# Altium schematic sheet current amplifier 05.SchDoc: PHOTOELECTRIC EFFECT
size A3; ApprovedBy: NHOPPASIT S.; CheckedBy: NHOPPASIT S.; Author: NHOPPASIT S.; DrawnBy: NHOPPASIT S.; DocumentNumber: EE-01; Revision: 1; SheetNumber: 1; SheetTotal: 1; Size: A3; PageSetup: Record=PageOptions|CenterHorizontal=True|CenterVertical=True|PrintScale=0.73|XCorrection=1.00|YCorrection=1.00|PrintKind=0|BorderSize=5000000|LeftOffset=0|BottomOffset=0|Orientation=2|PaperLength=1000|PaperWidth=1000|Scale=100|PaperSource=7|PrintQuality=-3|MediaType=1|DitherType=10|PrintScaleMode=1|PaperKind=A4|PaperIndex=9; DocumentName: PHOTOELECTRIC EFFECT SCH; ProjectName: PHOTOELECTRIC EFFECT 01
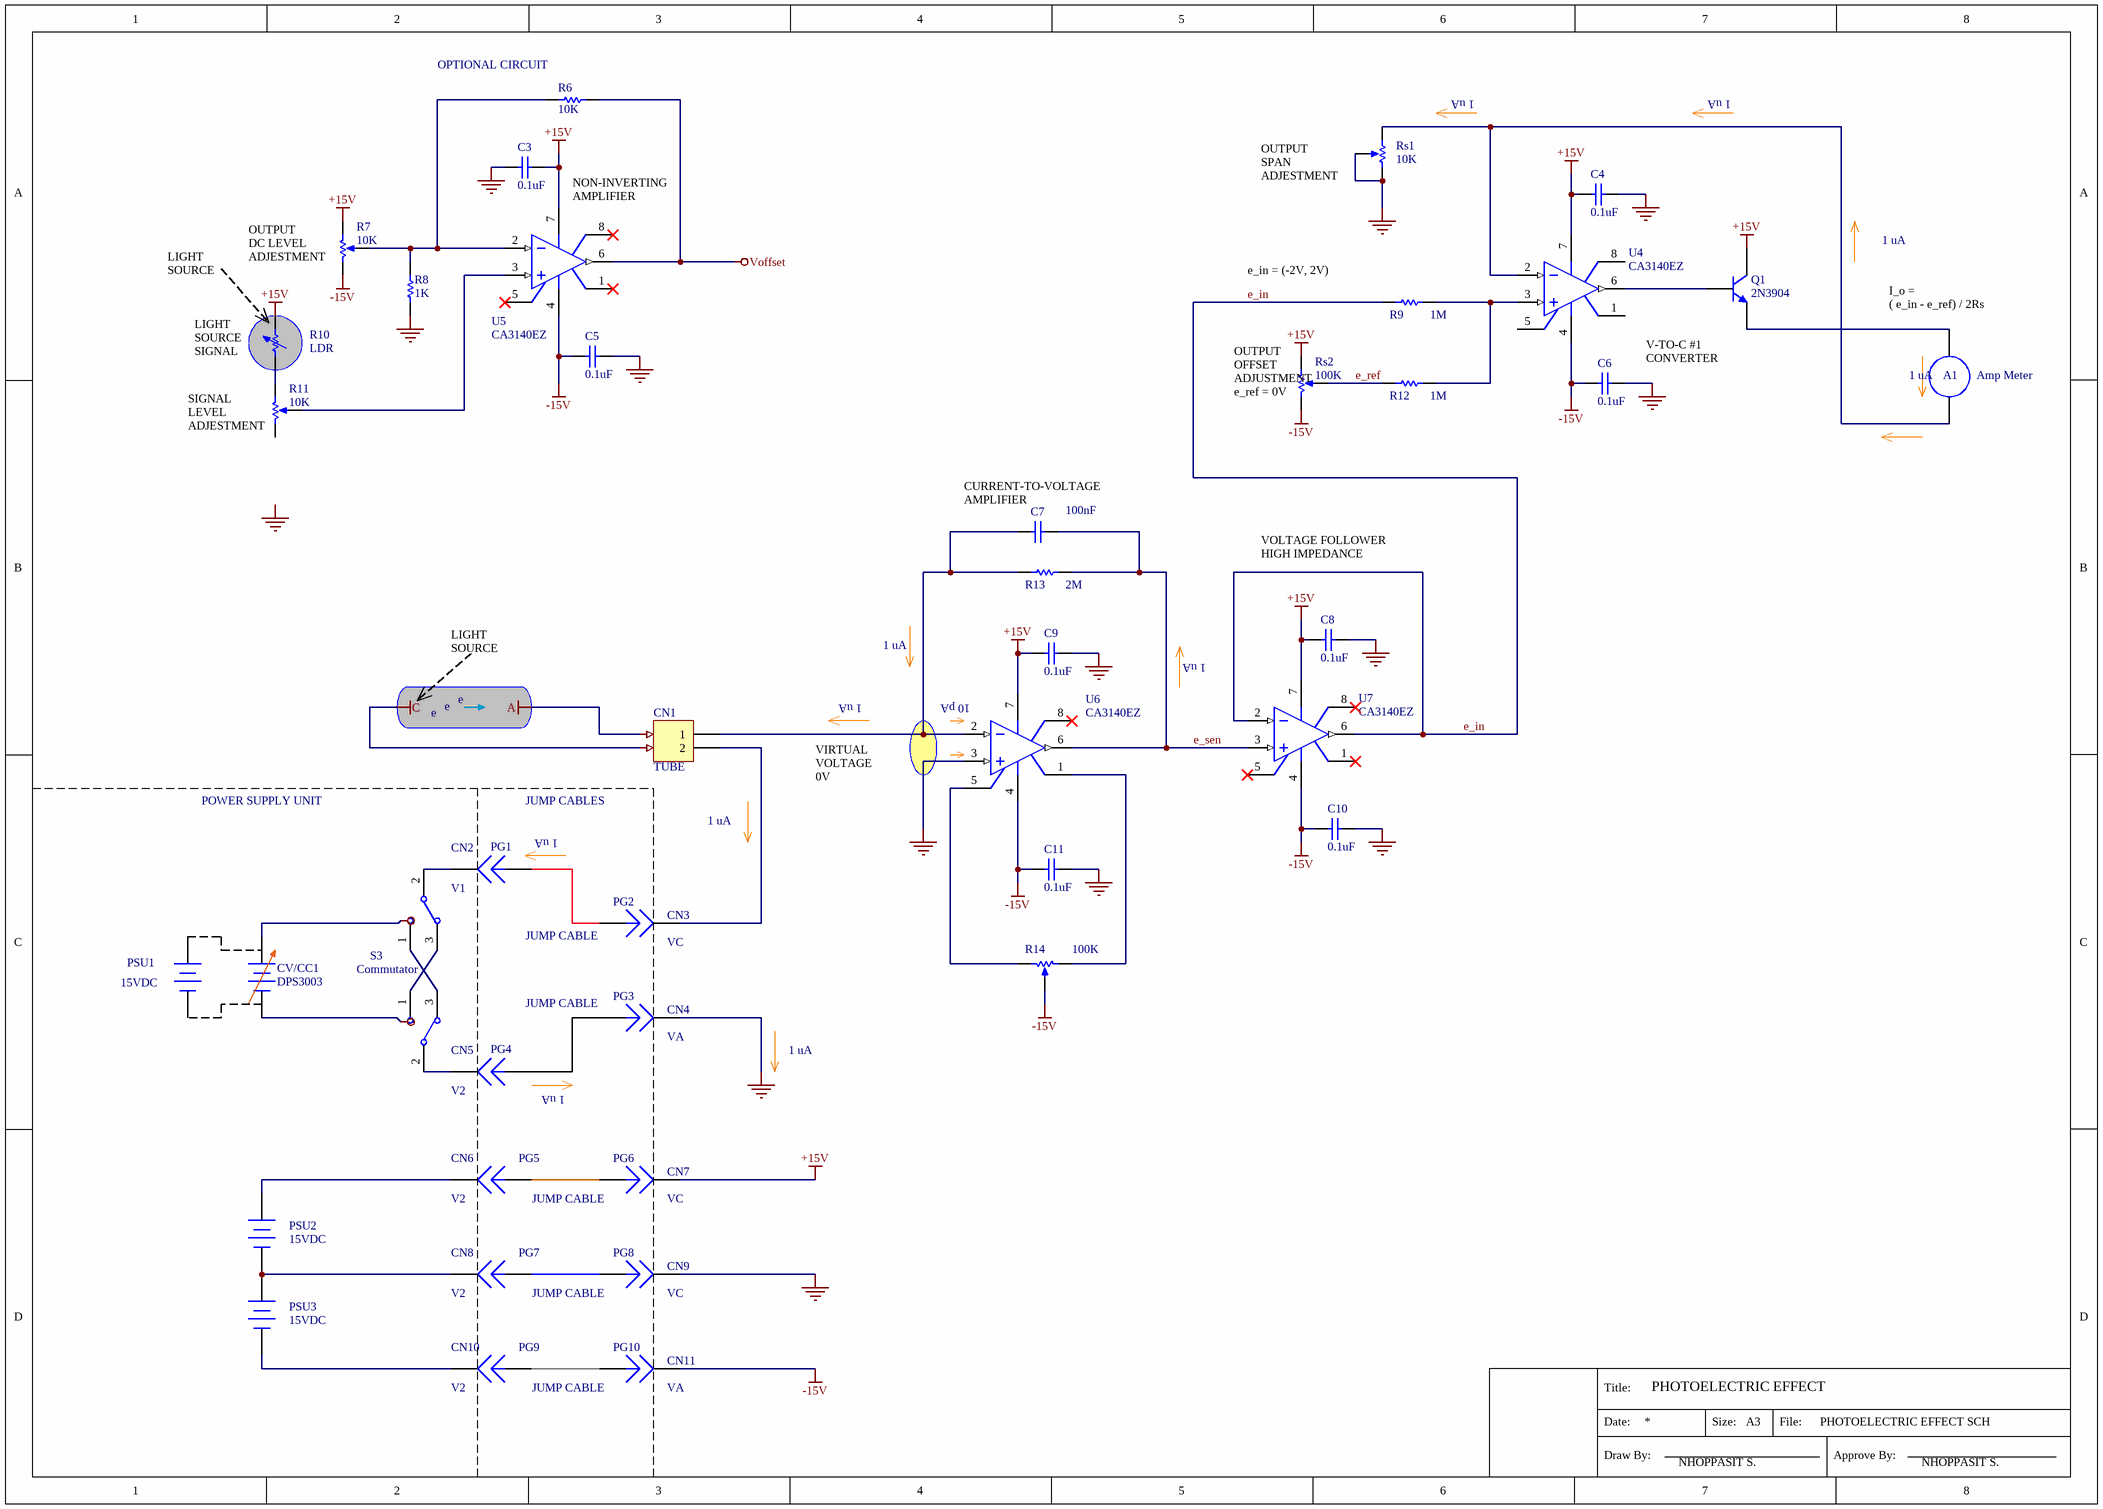
[diagram p0: current amplifier 05.SchDoc]

## Parts
A1  Amp Meter  [RAD-0.1]
C3  0.1uF  [RAD-0.3]
C4  0.1uF  [RAD-0.3]
C5  0.1uF  [RAD-0.3]
C6  0.1uF  [RAD-0.3]
C7  100nF  [RAD-0.3]
C8  0.1uF  [RAD-0.3]
C9  0.1uF  [RAD-0.3]
C10  0.1uF  [RAD-0.3]
C11  0.1uF  [RAD-0.3]
CN1  TUBE  [HDR1X2]
CN2  V1  [PIN1]
CN3  VC  [PIN1]
CN4  VA  [PIN1]
CN5  V2  [PIN1]
CN6  V2  [PIN1]
CN7  VC  [PIN1]
CN8  V2  [PIN1]
CN9  VC  [PIN1]
CN10  V2  [PIN1]
CN11  VA  [PIN1]
CV/CC1  DPS3003  [BAT-2]
PG1  Plug  [PIN1]  (value not drawn)
PG2  Plug  [PIN1]  (value not drawn)
PG3  Plug  [PIN1]  (value not drawn)
PG4  Plug  [PIN1]  (value not drawn)
PG5  Plug  [PIN1]  (value not drawn)
PG6  Plug  [PIN1]  (value not drawn)
PG7  Plug  [PIN1]  (value not drawn)
PG8  Plug  [PIN1]  (value not drawn)
PG9  Plug  [PIN1]  (value not drawn)
PG10  Plug  [PIN1]  (value not drawn)
PSU1  15VDC  [BAT-2]
PSU2  15VDC  [BAT-2]
PSU3  15VDC  [BAT-2]
Q1  2N3904  [TO-92A]
R6  10K  [AXIAL-0.3]
R7  10K  [VR5]
R8  1K  [AXIAL-0.3]
R9  1M  [AXIAL-0.3]
R10  LDR  [AXIAL-0.7]
R11  10K  [VR5]
R12  1M  [AXIAL-0.3]
R13  2M  [AXIAL-0.3]
R14  100K  [VR5]
Rs1  10K  [VR5]
Rs2  100K  [VR5]
S3  Commutator  [TL36WW15050]
S4  SW-SPDT  [TL36WW15050]  (value not drawn)
U4  CA3140EZ  [H-08A]
U5  CA3140EZ  [H-08A]
U6  CA3140EZ  [H-08A]
U7  CA3140EZ  [H-08A]

## Nets
+15V: C3.2 C4.1 C8.1 C9.1 CN7.1 Q1.3(C) R7.1(TOP) R10.2 Rs2.1(TOP) U4.7(V+) U5.7(V+) U6.7(V+) U7.7(V+)
-15V: C5.1 C6.1 C10.1 C11.1 CN11.1 R7.2(BOT) R14.3(TAP) Rs2.2(BOT) U4.4(V-) U5.4(V-) U6.4(V-) U7.4(V-)
A: CV/CC1.1(+) CV/CC1.2(-)  [also labelled C, VCC]
GND: C3.1 C4.2 C5.2 C6.2 C8.2 C9.2 C10.2 C11.2 CN4.1 CN9.1 R8.1 Rs1.2(BOT) Rs1.3(TAP) U6.3(IN+)
Voffset: R6.2 U5.6(OUT)
e_in: R9.1 U7.2(IN-) U7.6(OUT)
e_ref: R12.1 Rs2.3(TAP)
e_sen: C7.2 R13.2 U6.6(OUT) U7.3(IN+)
NetA1_1: A1.1 Rs1.1(TOP) U4.2(IN-)
NetA1_2: A1.2 Q1.1(E)
NetC7_1: C7.1 CN1.1 R13.1 U6.2(IN-)
NetCN1_2: CN1.2 CN3.1
NetCN2_1: CN2.1 S3.2
NetCN5_1: CN5.1 S4.2
NetCN6_1: CN6.1 PSU2.1(+)
NetCN8_1: CN8.1 PSU2.2(-) PSU3.1(+)
NetCN10_1: CN10.1 PSU3.2(-)
NetPG1_1: PG1.1 PG2.1
NetPG3_1: PG3.1 PG4.1
NetPG5_1: PG5.1 PG6.1
NetPG7_1: PG7.1 PG8.1
NetPG9_1: PG9.1 PG10.1
NetQ1_2: Q1.2(B) U4.6(OUT)
NetR6_1: R6.1 R7.3(TAP) R8.2 U5.2(IN-)
NetR9_2: R9.2 R12.2 U4.3(IN+)
NetR10_1: R10.1 R11.1(TOP)
NetR11_3: R11.3(TAP) U5.3(IN+)
NetR14_1: R14.1(TOP) U6.1(OS_NUL)
NetR14_2: R14.2(BOT) U6.5(OS_NUL)
NetS3_1: S3.1 S4.3
NetS3_3: S3.3 S4.1

Not connected (* = marked no-connect by the designer): PSU1 1(+) 2(-); R11 2(BOT); U4 1(OS_NUL) 5(OS_NUL) 8(TAB); U5 1(OS_NUL)* 5(OS_NUL)* 8(TAB)*; U6 8(TAB)*; U7 1(OS_NUL)* 5(OS_NUL)* 8(TAB)*

## Notes on the sheet
- (near R6) OPTIONAL CIRCUIT
- 1 uA
- (near Rs1) OUTPUT
  SPAN
  ADJESTMENT
- NON-INVERTING
  AMPLIFIER
- LIGHT SOURCE
- (near R7) OUTPUT
  DC LEVEL
  ADJESTMENT
- e_in = (-2V, 2V)
- (near A1) I_o =
  ( e_in - e_ref) / 2Rs
- (near R10) LIGHT SOURCE
  SIGNAL
- V-TO-C #1
  CONVERTER
- (near A1) 1 uA
- (near R11) SIGNAL
  LEVEL
  ADJESTMENT
- (near Rs2) OUTPUT
  OFFSET
  ADJUSTMENT
  e_ref = 0V
- (near C7) CURRENT-TO-VOLTAGE
  AMPLIFIER
- VOLTAGE FOLLOWER
  HIGH IMPEDANCE
- e
- (near U6) 10 pA
- VIRTUAL
  VOLTAGE
  0V
- POWER SUPPLY UNIT
- JUMP CABLES
- (near PG1) 1 uA
- JUMP CABLE
- (near PG4) 1 uA
- Labels drawn without touching a wire or pin: GND
- Title:
- Date:
- Draw By:
- Size:
- File:
- Approve By:

## Library data of the parts
A1 = Meter: Indicating Instrument; Note: Place a "letter" into the symbol to show the function of the meter or instrument; Published: 24-Mar-1999; LatestRevisionDate: 17-Jul-2002; LatestRevisionNote: Re-released for DXP Platform.; PackageReference: RAD-0.1; Publisher: Altium Limited; PackageDescription: Radial Cap, Thru-Hole; 2 Leads; 0.1 in Pin Spacing
C3-C11 = Cap: Capacitor; Published: 8-Jun-2000; LatestRevisionDate: 17-Jul-2002; LatestRevisionNote: Re-released for DXP Platform.; PackageReference: RAD-0.3; Publisher: Altium Limited; PackageDescription: Radial Cap, Thru-Hole; 2 Leads; 0.3 in Pin Spacing
  C3-C6 C8-C11: Value: 0.1uF
  C7: Value: 100nF
CN1 = Header 2: Header, 2-Pin; LatestRevisionDate: 17-Jul-2002; LatestRevisionNote: Re-released for DXP Platform.; Publisher: Altium Limited
CN2-CN11 = Socket: LatestRevisionDate: 17-Jul-2002; LatestRevisionNote: Re-released for DXP Platform.; Publisher: Altium Limited
CV/CC1 PSU1-PSU3 = Battery: Multicell Battery; Published: 24-Mar-1999; LatestRevisionDate: 17-Jul-2002; LatestRevisionNote: Re-released for DXP Platform.; PackageReference: BAT-2; Publisher: Altium Limited; PackageDescription: Battery; 2 Leads
Q1 = 2N3904: NPN General Purpose Amplifier; Published: 8-Jun-2000; LatestRevisionDate: 15-Jan-2003; LatestRevisionNote: PCB Footprint 'BCY-W3/D4.7' replaced; DatasheetVersion: 1997; PackageVersion: Sep-1998; PackageReference: TO-92A; Publisher: Altium Limited; PackageDescription: TO, Flat Index; 3 In-Line, Axial Leads; Body Dia. 4.5mm; Leads 0.51 x 0.48 mm (max); ComponentLink1Description: Manufacturer Link; ComponentLink1URL: http://www.fairchildsemi.com/; ComponentLink2Description: Datasheet; ComponentLink2URL: http://www.fairchildsemi.com/ds/2N%2F2N3904.pdf
R6 R8 R9 R12 R13 = Res1: Resistor; Published: 8-Jun-2000; LatestRevisionDate: 17-Jul-2002; LatestRevisionNote: Re-released for DXP Platform.; PackageReference: AXIAL-0.3; Publisher: Altium Limited; PackageDescription: Axial Device, Thru-Hole; 2 Leads; 0.3 in Pin Spacing
  R6: Value: 10K
  R8: Value: 1K
  R9 R12: Value: 1M
  R13: Value: 2M
R7 R11 R14 Rs1 Rs2 = RPot: Potentiometer; Sim Note: Enter the Resistance value and the set point into parameter fields.; Set Position: 0.5; Published: 8-Jun-2000; LatestRevisionDate: 17-Jul-2002; LatestRevisionNote: Re-released for DXP Platform.; PackageReference: VR5; Publisher: Altium Limited; PackageDescription: Variable Resistor, Thru-Hole; 3 Leads
  R7 R11 Rs1: Value: 10K
  R14 Rs2: Value: 100K
R10 = Res Adj1: Variable Resistor; Value: 1K; Set Position: 0.5; Published: 8-Jun-2000; LatestRevisionDate: 17-Jul-2002; LatestRevisionNote: Re-released for DXP Platform.; PackageReference: AXIAL-0.7; Publisher: Altium Limited; PackageDescription: Axial Device, Thru-Hole; 2 Leads; 0.7 in Pin Spacing
S3 S4 = SW-SPDT: SPDT Subminiature Toggle Switch, Right Angle Mounting, Vertical Actuation; Published: 24-Mar-1999; LatestRevisionDate: 17-Dec-2003; LatestRevisionNote: Schematic revised, PCB Footprint replaced.; DatasheetVersion: 05-Dec-2000; PackageReference: TL36WW15050; Publisher: Altium Limited; PackageDescription: Switch; 4 Leads; ComponentLink1Description: Manufacturer Link; ComponentLink1URL: http://www.apem.com
U4-U7 = Op Amp: FET Operational Amplifier; Published: 8-Jun-2000; LatestRevisionDate: 17-Jul-2002; LatestRevisionNote: Re-released for DXP Platform.; DatasheetVersion: REV. B; PackageVersion: 1990; PackageReference: H-08A; Publisher: Altium Limited; PackageDescription: Can; 8 Leads; Pin Circle Dia. 5.08 mm; Lead Dia. 0.53 mm (max); ComponentLink1Description: Manufacturer Link; ComponentLink1URL: http://www.analog.com/
PG1-PG10 = Plug: LatestRevisionDate: 17-Jul-2002; LatestRevisionNote: Re-released for DXP Platform.; Publisher: Altium Limited